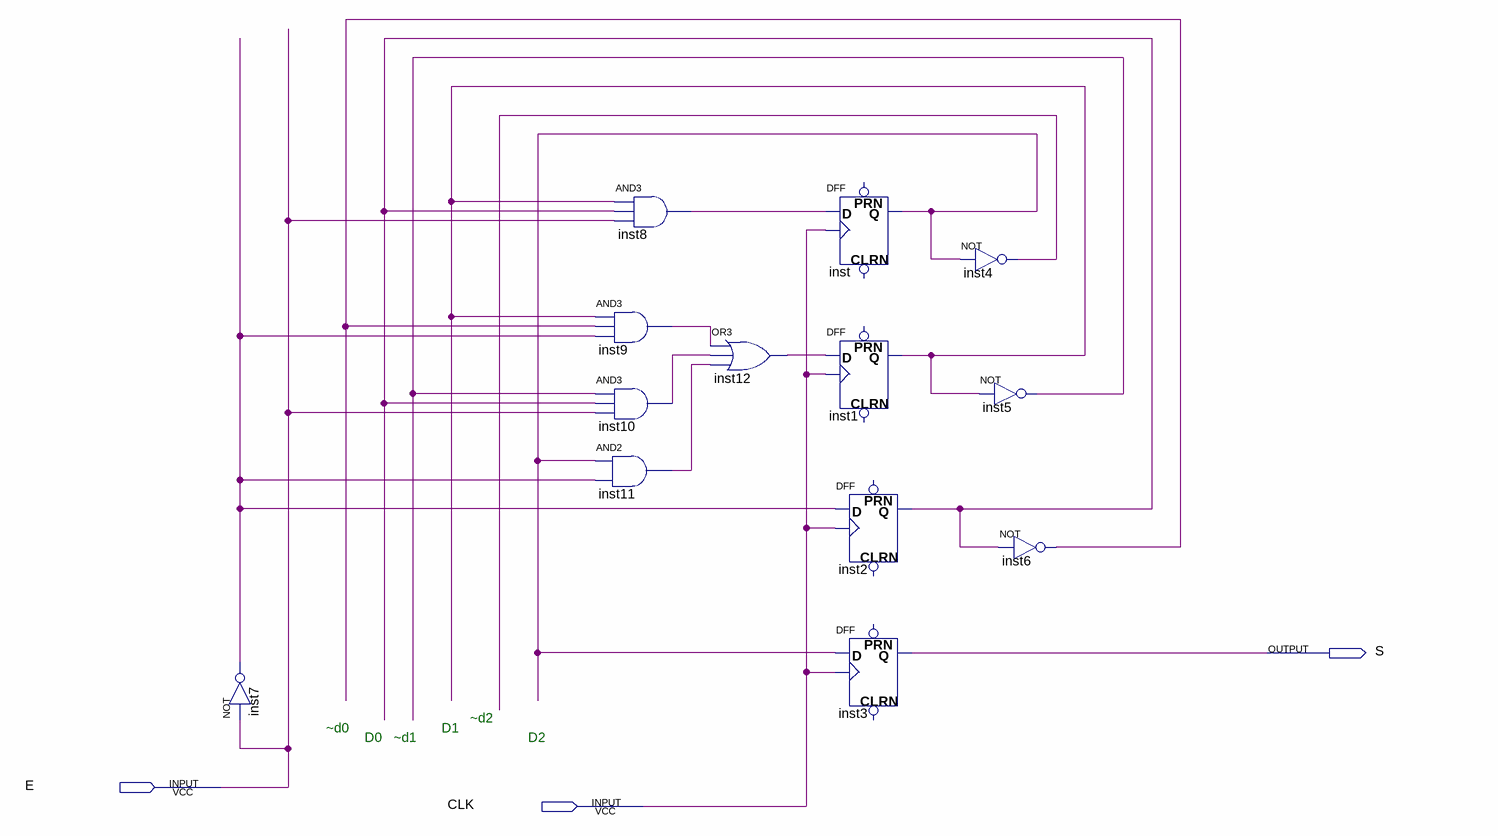
[diagram p0: schematic sheet]
// Quartus schematic uno.bdf as structural Verilog: 13 symbols, 3 pins
module uno (
  input  E,
  input  CLK,
  output S
);

  wire inst1_q, inst2_q, inst4_out, inst5_out, inst6_out, inst7_out, inst8_out, inst9_out, inst10_out,
       inst11_out, inst12_out, inst_q;

  not inst7 (inst7_out, E);
  and inst9 (inst9_out, inst1_q, inst6_out, inst7_out);
  and inst10 (inst10_out, inst5_out, inst2_q, E);
  and inst11 (inst11_out, inst_q, inst7_out);
  and inst8 (inst8_out, inst1_q, inst2_q, E);
  or inst12 (inst12_out, inst9_out, inst10_out, inst11_out);
  DFF inst (.CLK(CLK), .D(inst8_out), .Q(inst_q));  // open: CLRN, PRN
  DFF inst1 (.CLK(CLK), .D(inst12_out), .Q(inst1_q));  // open: CLRN, PRN
  DFF inst2 (.CLK(CLK), .D(inst7_out), .Q(inst2_q));  // open: CLRN, PRN
  DFF inst3 (.CLK(CLK), .D(inst_q), .Q(S));  // open: CLRN, PRN
  not inst4 (inst4_out, inst_q);
  not inst5 (inst5_out, inst1_q);
  not inst6 (inst6_out, inst2_q);

  // Notes on the sheet:
  //   ~d2
  //   ~d0
  //   D1
  //   D0
  //   ~d1
  //   D2
endmodule
